# Altium schematic sheet DCDC_1_rev3.schdoc
size 521 x 193 mm; SheetNumber: 1; SheetTotal: 1
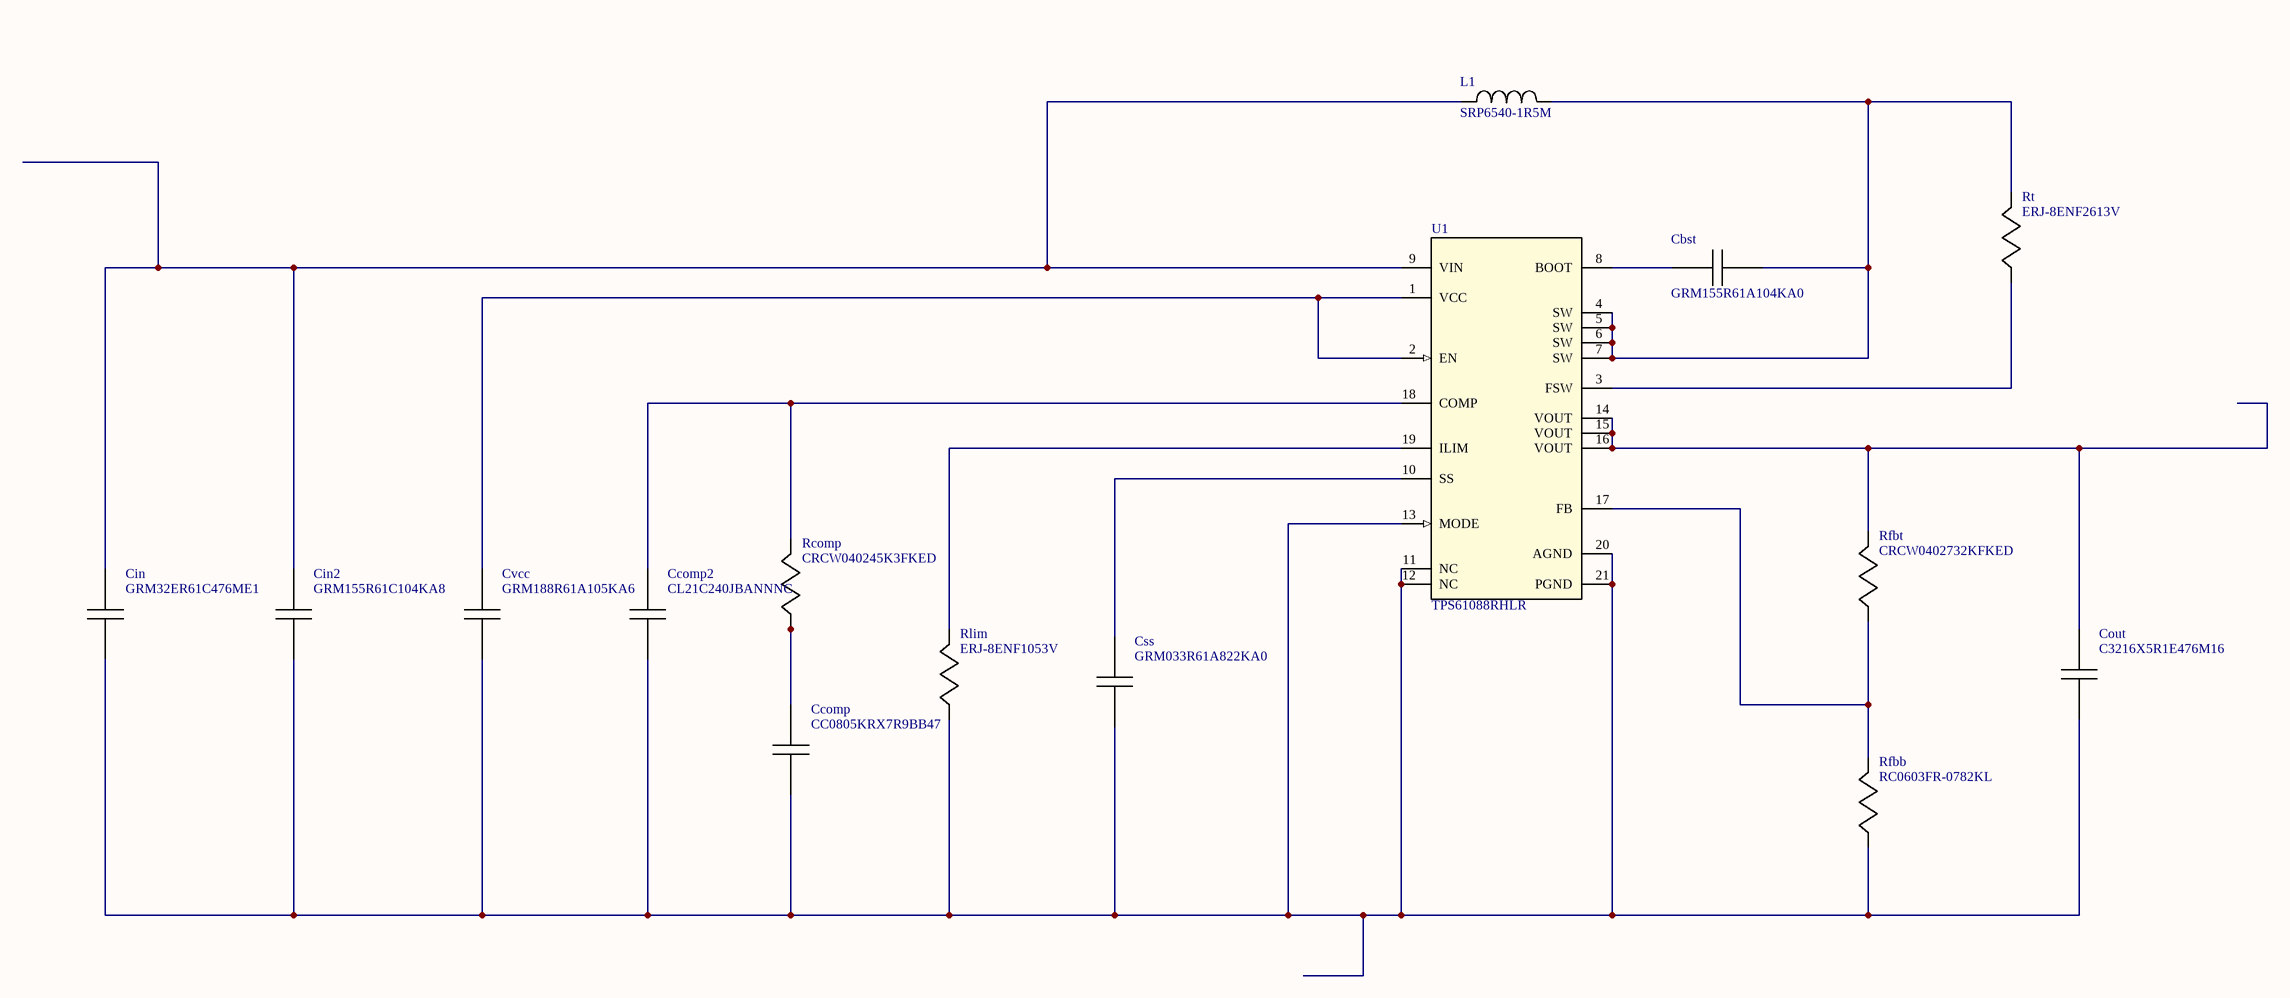
[diagram p0: DCDC_1_rev3.schdoc]

## Parts
Cbst  GRM155R61A104KA0  [0402]
Ccomp  CC0805KRX7R9BB47  [0805]
Ccomp2  CL21C240JBANNNC  [0805]
Cin  GRM32ER61C476ME1  [1210_280]
Cin2  GRM155R61C104KA8  [0402]
Cout  C3216X5R1E476M16  [1206_190]
Css  GRM033R61A822KA0  [0201]
Cvcc  GRM188R61A105KA6  [0603]
L1  SRP6540-1R5M  [SRP6540]
Rcomp  CRCW040245K3FKED  [0402]
Rfbb  RC0603FR-0782KL  [0603]
Rfbt  CRCW0402732KFKED  [0402]
Rlim  ERJ-8ENF1053V  [1206]
Rt  ERJ-8ENF2613V  [1206]
U1  TPS61088RHLR  [RHL0020A]

## Nets
NetCbst_1: Cbst.1 L1.2 Rt.1 U1.4(SW) U1.5(SW) U1.6(SW) U1.7(SW)
NetCbst_2: Cbst.2 U1.8(BOOT)
NetCcomp2_1: Ccomp2.1 Rcomp.1 U1.18(COMP)
NetCcomp_1: Ccomp.1 Rcomp.2
NetCcomp_2: Ccomp.2 Ccomp2.2 Cin.2 Cin2.2 Cout.2 Css.2 Cvcc.2 Rfbb.2 Rlim.2 U1.11(NC) U1.12(NC) U1.13(MODE) U1.20(AGND) U1.21(PGND)
NetCin_1: Cin.1 Cin2.1 L1.1 U1.9(VIN)
NetCout_1: Cout.1 Rfbt.1 U1.14(VOUT) U1.15(VOUT) U1.16(VOUT)
NetCss_1: Css.1 U1.10(SS)
NetCvcc_1: Cvcc.1 U1.1(VCC) U1.2(EN)
NetRfbb_1: Rfbb.1 Rfbt.2 U1.17(FB)
NetRlim_1: Rlim.1 U1.19(ILIM)
NetRt_2: Rt.2 U1.3(FSW)

## Library data of the parts
Cbst = GRM155R61A104KA0: Imported; Manufacturer_Part_Number: GRM155R61A104KA01D; Vendor: MuRata; Value: 100nF; Manufacturer_Name: MuRata; RefDes: RefDes; TYPE: TYPE
Ccomp = CC0805KRX7R9BB47: Imported; Manufacturer_Part_Number: CC0805KRX7R9BB471; Vendor: Yageo America; Value: 470pF; Manufacturer_Name: Yageo America; RefDes: RefDes; TYPE: TYPE
Ccomp2 = CL21C240JBANNNC: Imported; Vendor: Samsung Electro-Mechanics; Value: 24pF; Manufacturer_Part_Number: CL21C240JBANNNC; Manufacturer_Name: Samsung Electro-Mechanics; RefDes: RefDes; TYPE: TYPE
Cin = GRM32ER61C476ME1: Imported; Manufacturer_Part_Number: GRM32ER61C476ME15L; Vendor: MuRata; Value: 47uF; Manufacturer_Name: MuRata; RefDes: RefDes; TYPE: TYPE
Cin2 = GRM155R61C104KA8: Imported; Manufacturer_Part_Number: GRM155R61C104KA88D; Vendor: MuRata; Value: 100nF; Manufacturer_Name: MuRata; RefDes: RefDes; TYPE: TYPE
Cout = C3216X5R1E476M16: Imported; Manufacturer_Part_Number: C3216X5R1E476M160AC; Manufacturer_Name: TDK; Cap_F: 0.000047; VDC_V: 25; RoHS: Y; MountType: SMT; RefDes: RefDes; TYPE: TYPE; Value: Value
Css = GRM033R61A822KA0: Imported; Manufacturer_Part_Number: GRM033R61A822KA01D; Vendor: MuRata; Value: 8.2nF; Manufacturer_Name: MuRata; RefDes: RefDes; TYPE: TYPE
Cvcc = GRM188R61A105KA6: Imported; Manufacturer_Part_Number: GRM188R61A105KA61D; Vendor: MuRata; Value: 1uF; Manufacturer_Name: MuRata; RefDes: RefDes; TYPE: TYPE
L1 = SRP6540-1R5M: Imported; Vendor: Bourns; Value: 1.5uH; Manufacturer_Part_Number: SRP6540-1R5M; PACKAGE_DESIGNATOR: SRP6540; Manufacturer: Bourns; Manufacturer_Name: Bourns; RefDes: RefDes; TYPE: TYPE
Rcomp = CRCW040245K3FKED: Imported; Vendor: Vishay-Dale; Value: 45.3k; Manufacturer_Part_Number: CRCW040245K3FKED; Manufacturer_Name: Vishay-Dale; RefDes: RefDes; TYPE: TYPE
Rfbb = RC0603FR-0782KL: Imported; Vendor: Yageo America; Value: 82k; Manufacturer_Part_Number: RC0603FR-0782KL; Manufacturer_Name: Yageo America; RefDes: RefDes; TYPE: TYPE
Rfbt = CRCW0402732KFKED: Imported; Vendor: Vishay-Dale; Value: 732k; Manufacturer_Part_Number: CRCW0402732KFKED; Manufacturer_Name: Vishay-Dale; RefDes: RefDes; TYPE: TYPE
Rlim = ERJ-8ENF1053V: Imported; Vendor: Panasonic; Value: 105k; Manufacturer_Part_Number: ERJ-8ENF1053V; Manufacturer_Name: Panasonic; RefDes: RefDes; TYPE: TYPE
Rt = ERJ-8ENF2613V: Imported; Vendor: Panasonic; Value: 261k; Manufacturer_Part_Number: ERJ-8ENF2613V; Manufacturer_Name: Panasonic; RefDes: RefDes; TYPE: TYPE
U1 = TPS61088RHLR: Imported; Alternate PartNumber: TPS61088RHLT; Manufacturer: Texas Instruments; CompType: IC; PIN_COUNT: 21; Application_BuildNumber: *; PartNumber: TPS61088RHLR; PackageReference: RHL0020A; MountType: SMT; RoHS: Y; RefDes: RefDes; TYPE: TYPE; Value: Value; Manufacturer_Part_Number: TPS61088RHLR; Manufacturer_Name: Texas Instruments